# Altium project ThermalCamV1.PrjPcb
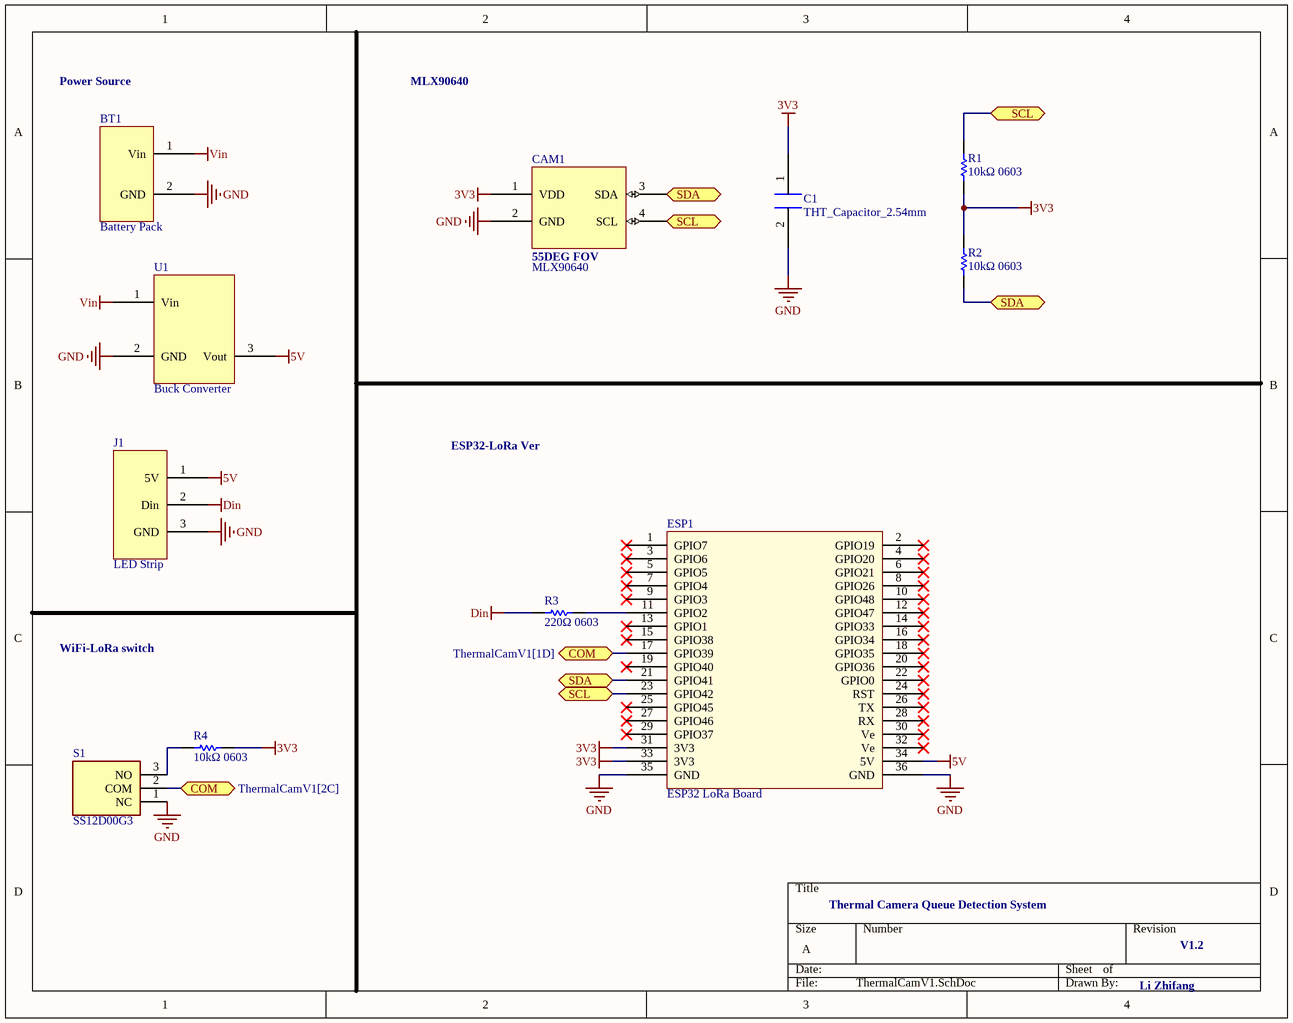
[diagram p0: ThermalCamV1.SchDoc]
1 sheet, 11 parts. Net scope: flat (ports and power ports of the same name join across sheets).
Board file: ThermalCamV1.PcbDoc

## Sheet ThermalCamV1.SchDoc
size A; SheetNumber: 1; SheetTotal: 1

### Parts
BT1  Battery Pack  [Battery Pads]
C1  THT_Capacitor_2.54mm  [THT_Capacitor_2.54mm_Small]
CAM1  MLX90640  [MLX90640]
ESP1  ESP32 LoRa Board  [ESP32 LoRa Board]
J1  LED Strip  [LED Strip]
R1  10kΩ 0603  [RESC1609X50X30NL8T20]
R2  10kΩ 0603  [RESC1609X50X30NL8T20]
R3  220Ω 0603  [RESC1609X50X30NL8T20]
R4  10kΩ 0603  [RESC1609X50X30NL8T20]
S1  SS12D00G3  [SS12D00G3]
U1  Buck Converter  [BuckConverter]

### Ports
COM (bidir, see ThermalCamV1[1D]), COM (bidir, see ThermalCamV1[2C]), SCL (bidir, see ThermalCamV1[2C], ThermalCamV1[3A]), SCL (bidir, see ThermalCamV1[2C], ThermalCamV1[4A]), SCL (bidir, see ThermalCamV1[3A], ThermalCamV1[4A]), SDA (bidir, see ThermalCamV1[2C], ThermalCamV1[3A]), SDA (bidir, see ThermalCamV1[2C], ThermalCamV1[4B]), SDA (bidir, see ThermalCamV1[3A], ThermalCamV1[4B])

### Nets
3V3: C1.1(GND) CAM1.1(VDD) ESP1.31(3V3) ESP1.33(3V3) R1.1 R2.2 R4.1
5V: ESP1.34(5V) J1.1(5V) U1.3(Vout)
Din: J1.2(Din) R3.2
GND: BT1.2(GND) C1.2(GND) CAM1.2(GND) ESP1.35(GND) ESP1.36(GND) J1.3(GND) S1.1(NC) U1.2(GND)
Vin: BT1.1(Vin) U1.1(Vin)
NetCAM1_3: CAM1.3(SDA) ESP1.21(GPIO41) R2.1 ; port SDA
NetCAM1_4: CAM1.4(SCL) ESP1.23(GPIO42) R1.2 ; port SCL
NetESP1_11: ESP1.11(GPIO2) R3.1
NetESP1_17: ESP1.17(GPIO39) S1.2(COM) ; port COM
NetR4_2: R4.2 S1.3(NO)

Not connected (* = marked no-connect by the designer): ESP1 1(GPIO7)* 2(GPIO19)* 3(GPIO6)* 4(GPIO20)* 5(GPIO5)* 6(GPIO21)* 7(GPIO4)* 8(GPIO26)* 9(GPIO3)* 10(GPIO48)* 12(GPIO47)* 13(GPIO1)* 14(GPIO33)* 15(GPIO38)* 16(GPIO34)* 18(GPIO35)* 19(GPIO40)* 20(GPIO36)* 22(GPIO0)* 24(RST)* 25(GPIO45)* 26(TX)* 27(GPIO46)* 28(RX)* 29(GPIO37)* 30(Ve)* 32(Ve)*

### Notes on the sheet
- Power Source
- MLX90640
- ESP32-LoRa Ver
- WiFi-LoRa switch
- Thermal Camera Queue Detection System
- Li Zhifang
- V1.2
- (in symbol MLX90640) 55DEG FOV

### Library data of the parts
R1-R4 = CMP-2000-03816-5: Chip Resistor, 0 Ohm, Jumper, 100 mW, -55 to 155 degC, 0603 (1608 Metric), RoHS, Tape and Reel; Manufacturer: Vishay Semiconductor; Voltage Rating: 75 V; Package Quantity: 5000; DatasheetVersion: 06/2012; Min Operating Temperature: -55 degC; ComponentLink1URL: http://www.vishay.com/; Mounting Technology: Surface Mount; Height: 0.45 mm; ComponentLink1Description: Manufacturer URL; REACH SVHC: Unknown; PackageReference: 0603; Packaging: Tape and Reel; Max Operating Temperature: 155 degC; Mount: Surface Mount; ComponentLink2Description: Datasheet; PackageDescription: 2-Pin Surface Mount Device, Body 1.575 x 0.85 mm; Length: 1.55 mm; ComponentLink2URL: http://www.vishay.com/docs/20035/dcrcwe3.pdf; Pins: 2; RoHSCompliant: true
S1 = SS12D00G3: Switch; Manufacturer_Name: Vimex; Datasheet Link: http://vimex.com/switches/techdocs/SS12D00-tech.pdf; Height: 7mm; Manufacturer_Part_Number: SS12D00G3